# EasyEDA Pro project ProPrj_STM32G474RET6_2026-01-30.epro, schematic Schematic2
Board Name: Board2; Create Date: 2025-07-26; Page Name: P1; Project Name: STM32G474RET6; Schematic Name: Schematic2; Update Date: 2025-07-26; Company: 嘉立创EDA; Page Size: A2; Version: V1.0
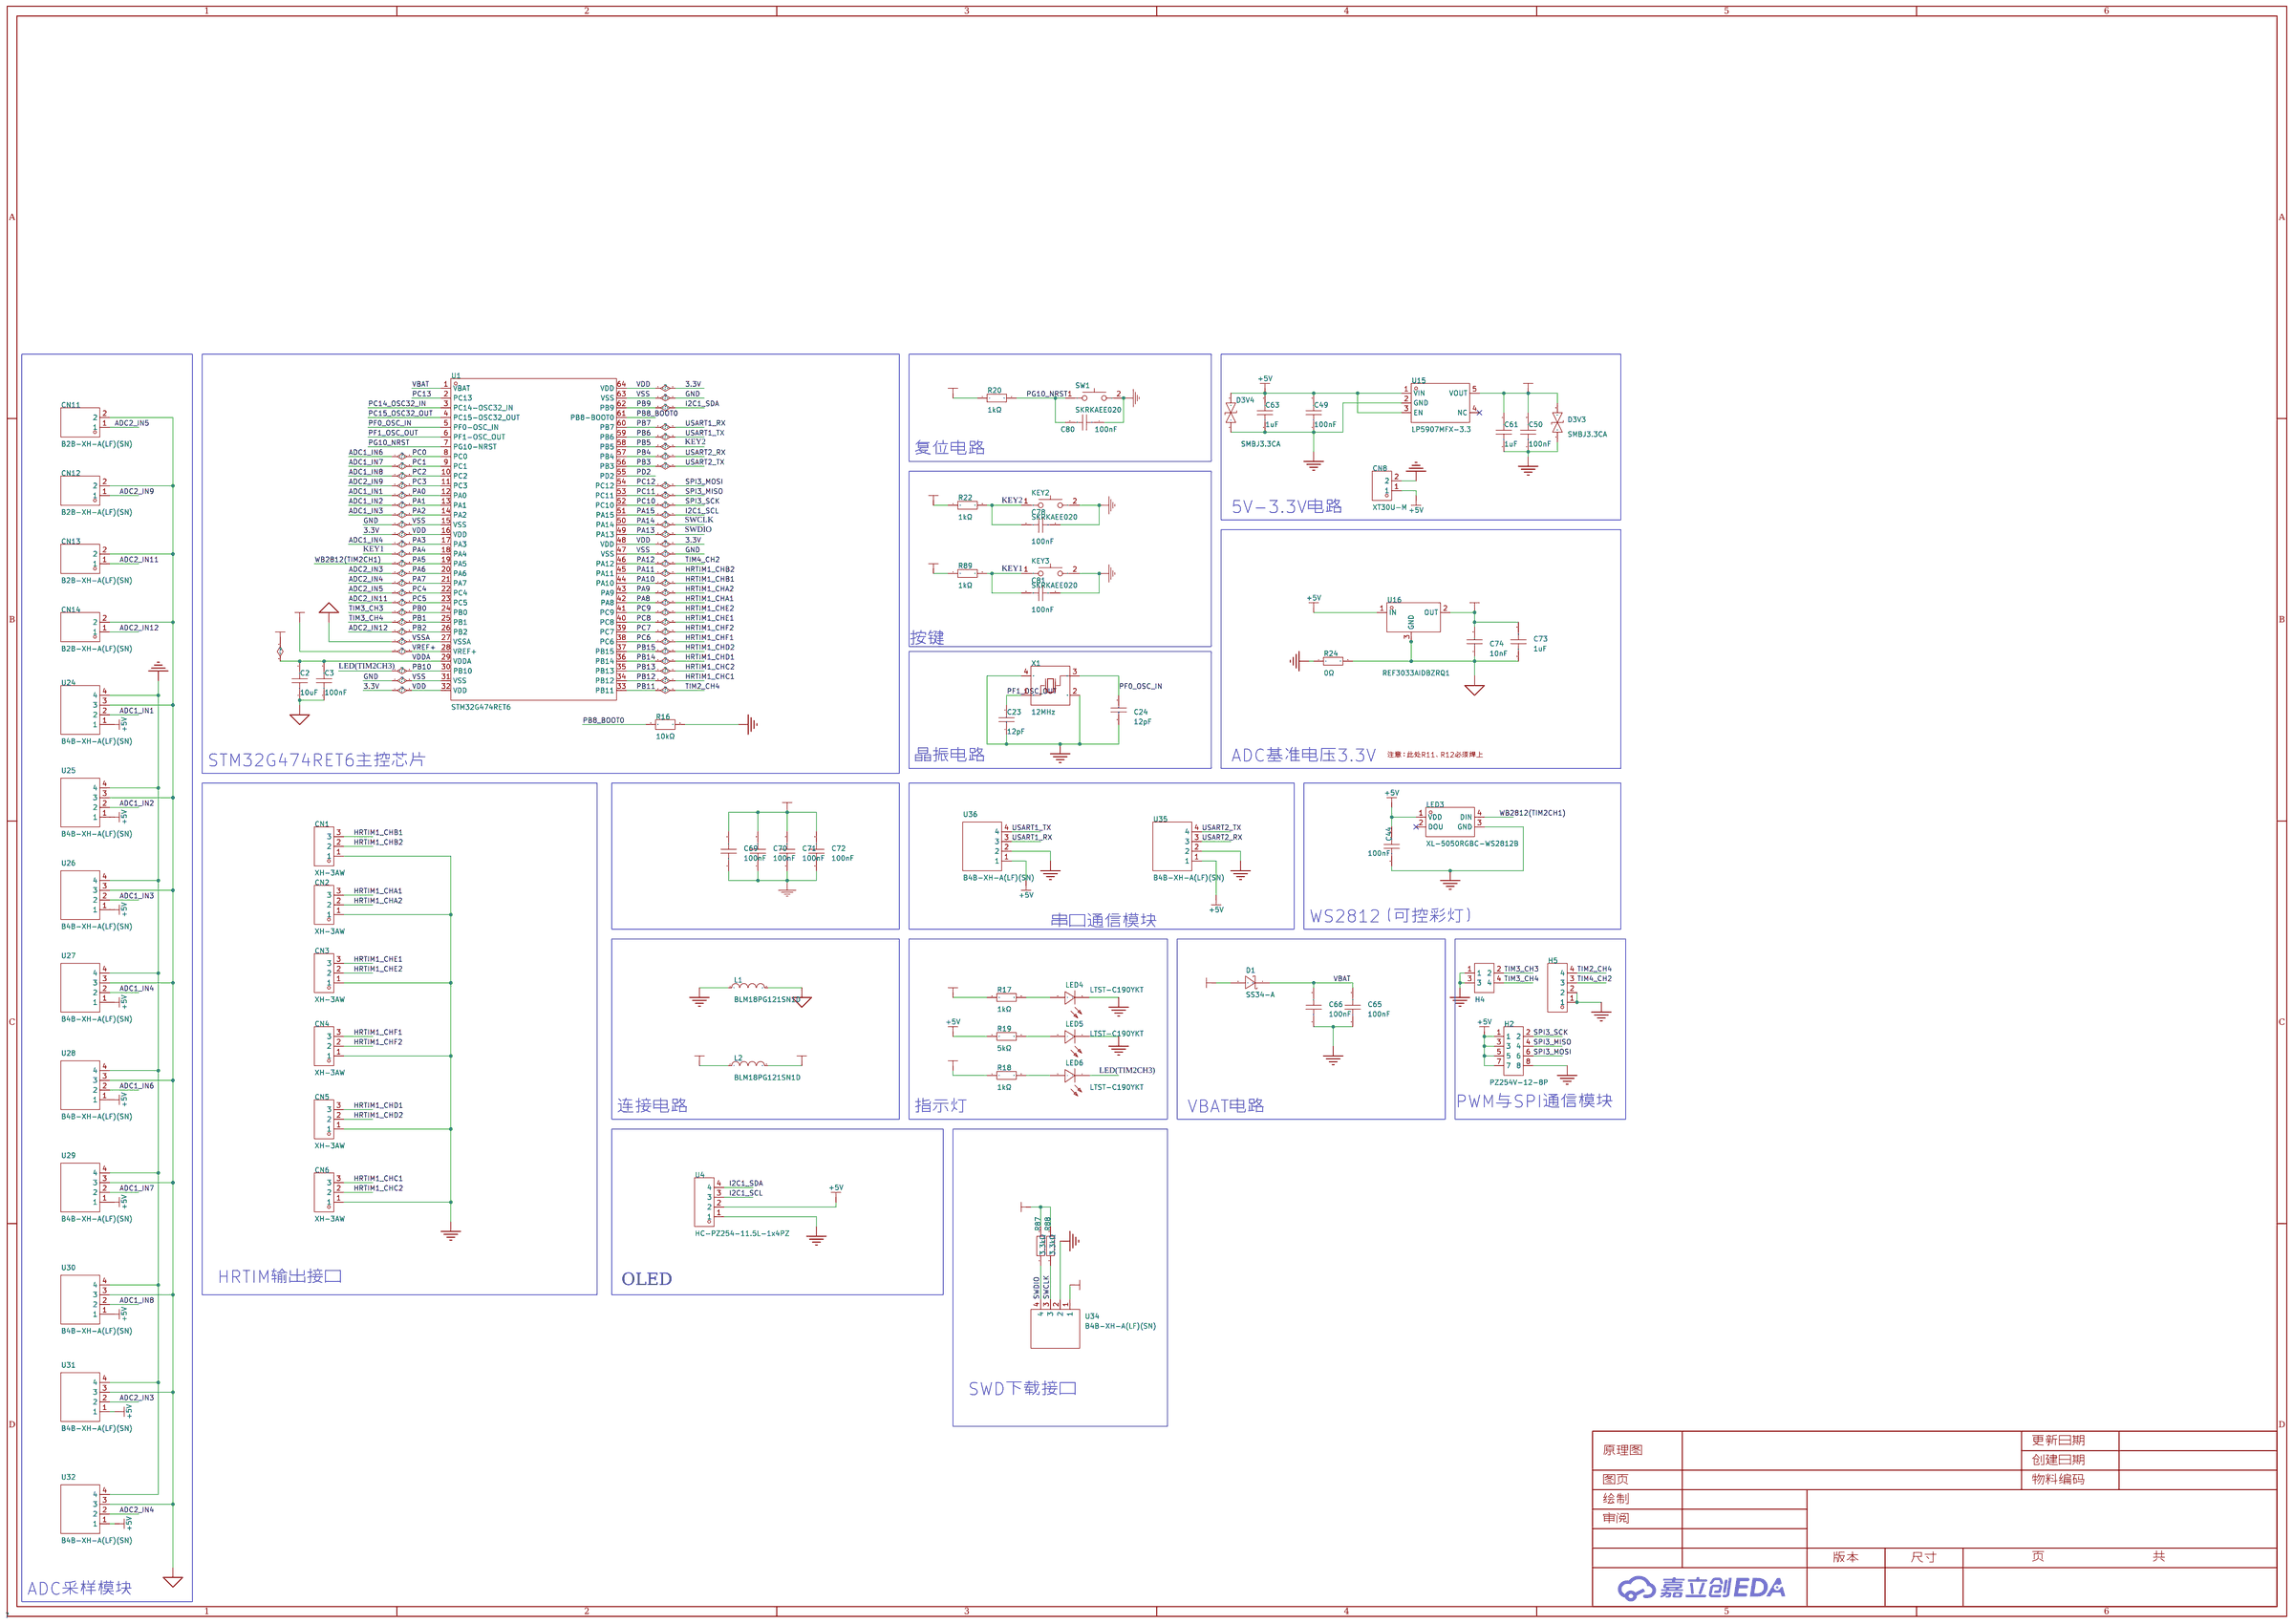
[diagram p1: schematic sheet]

## Parts
C2  10uF  [C0603]
C3  100nF  [C0603]
C23  12pF  [C0603]
C24  12pF  [C0603]
C44  100nF  [C0603]
C49  100nF  [C0603]
C50  100nF  [C0603]
C61  1uF  [C0603]
C63  1uF  [C0603]
C65  100nF  [C0603]
C66  100nF  [C0603]
C69  100nF  [C0603]
C70  100nF  [C0603]
C71  100nF  [C0603]
C72  100nF  [C0603]
C73  1uF  [C0603]
C74  10nF  [C0603]
C78  100nF  [C0603]
C80  100nF  [C0603]
C81  100nF  [C0603]
CN1  XH-3AW  [CONN-TH_3P-P2.54_HCTL_XH-3AW]
CN2  XH-3AW  [CONN-TH_3P-P2.54_HCTL_XH-3AW]
CN3  XH-3AW  [CONN-TH_3P-P2.54_HCTL_XH-3AW]
CN4  XH-3AW  [CONN-TH_3P-P2.54_HCTL_XH-3AW]
CN5  XH-3AW  [CONN-TH_3P-P2.54_HCTL_XH-3AW]
CN6  XH-3AW  [CONN-TH_3P-P2.54_HCTL_XH-3AW]
CN8  XT30U-M  [CONN-TH_XT30U-M]
CN11  B2B-XH-A(LF)(SN)  [CONN-TH_B2B-XH-A-LF-SN]
CN12  B2B-XH-A(LF)(SN)  [CONN-TH_B2B-XH-A-LF-SN]
CN13  B2B-XH-A(LF)(SN)  [CONN-TH_B2B-XH-A-LF-SN]
CN14  B2B-XH-A(LF)(SN)  [CONN-TH_B2B-XH-A-LF-SN]
D1  SS34-A  [SMA_L4.3-W2.6-LS5.2-RD]
D3V3  SMBJ3.3CA  [SMB_L4.6-W3.5-LS5.3-BI]
D3V4  SMBJ3.3CA  [SMB_L4.6-W3.5-LS5.3-BI]
H2  PZ254V-12-8P  [HDR-TH_8P-P2.54-V-M-R2-C4-S2.54]
H4  PZ254V-12-4P  [HDR-TH_4P-P2.54-V-M-R2-C2-S2.54]
H5  PZ254V-11-04P  [HDR-TH_4P-P2.54-V-M]
KEY2  SKRKAEE020  [SW-SMD_L3.9-W3.0-P4.45]
KEY3  SKRKAEE020  [SW-SMD_L3.9-W3.0-P4.45]
L1  BLM18PG121SN1D  [L0603]
L2  BLM18PG121SN1D  [L0603]
LED3  XL-5050RGBC-WS2812B  [LED-SMD_4P-L5.0-W5.0-BL_XL-5050RGBC]
LED4  LTST-C190YKT  [LED0603-RD]
LED5  LTST-C190YKT  [LED0603-RD]
LED6  LTST-C190YKT  [LED0603-RD]
R16  10kΩ  [R0603]
R17  1kΩ  [R0603]
R18  1kΩ  [R0603]
R19  5kΩ  [R0603]
R20  1kΩ  [R0603]
R22  1kΩ  [R0603]
R24  0Ω  [R0603]
R87  3.3kΩ  [R0603]
R88  3.3kΩ  [R0603]
R89  1kΩ  [R0603]
SW1  SKRKAEE020  [SW-SMD_L3.9-W3.0-P4.45]
U1  STM32G474RET6  [LQFP-64_L10.0-W10.0-P0.50-LS12.0-BL]
U4  HC-PZ254-11.5L-1x4PZ  [HDR-TH_4P-P2.54-V-M-4]
U15  LP5907MFX-3.3  [SOT-23-5_L3.0-W1.7-P0.95-LS2.8-BR]
U16  REF3033AIDBZRQ1  [SOT-23-3_L2.9-W1.3-P1.90-LS2.4-BR]
U24  B4B-XH-A(LF)(SN)  [CONN-TH_B4B-XH-A-LF-SN]
U25  B4B-XH-A(LF)(SN)  [CONN-TH_B4B-XH-A-LF-SN]
U26  B4B-XH-A(LF)(SN)  [CONN-TH_B4B-XH-A-LF-SN]
U27  B4B-XH-A(LF)(SN)  [CONN-TH_B4B-XH-A-LF-SN]
U28  B4B-XH-A(LF)(SN)  [CONN-TH_B4B-XH-A-LF-SN]
U29  B4B-XH-A(LF)(SN)  [CONN-TH_B4B-XH-A-LF-SN]
U30  B4B-XH-A(LF)(SN)  [CONN-TH_B4B-XH-A-LF-SN]
U31  B4B-XH-A(LF)(SN)  [CONN-TH_B4B-XH-A-LF-SN]
U32  B4B-XH-A(LF)(SN)  [CONN-TH_B4B-XH-A-LF-SN]
U34  B4B-XH-A(LF)(SN)  [CONN-TH_B4B-XH-A-LF-SN]
U35  B4B-XH-A(LF)(SN)  [CONN-TH_B4B-XH-A-LF-SN]
U36  B4B-XH-A(LF)(SN)  [CONN-TH_B4B-XH-A-LF-SN]
X1  12MHz  [CRYSTAL-SMD_4P-L3.2-W2.5-BL]

## Library data of the parts
C2 = CGA0603X5R106K100JT: 容值:10uF;精度:±10%;额定电压:10V;温度系数:X5R;; LCSC Part Name: 10uF ±10% 10V; Supplier Part: C6119842; Manufacturer: HRE(芯声); Supplier Footprint: 0603; JLCPCB Part Class: 扩展库; Supplier: LCSC; Tolerance: ±10%; Voltage Rating: 10V; Temperature Coefficient: X5R
C3 C65 C66 C69-C72 = CGA0603X7R104K500JT: 容值:100nF;精度:±10%;额定电压:50V;温度系数:X7R;; LCSC Part Name: 100nF ±10% 50V; Supplier Part: C6119867; Manufacturer: HRE(芯声); Supplier Footprint: 0603; JLCPCB Part Class: 扩展库; Datasheet: https://atta.szlcsc.com/upload/public/pdf/source/20250103/C44077DA9E7B3EFAE02F22B6D3D1CBC9.pdf; Supplier: LCSC; Tolerance: ±10%; Voltage Rating: 50V; Temperature Coefficient: X7R
C23 C24 = CC0603JRNPO9BN120: 容值:12pF;精度:±5%;额定电压:50V;材质(温度系数):NP0;; LCSC Part Name: 12pF ±5% 50V; Supplier Part: C107034; Manufacturer: YAGEO(国巨); Supplier Footprint: 0603; JLCPCB Part Class: Extended Part; Datasheet: https://atta.szlcsc.com/upload/public/pdf/source/20170420/1492670686468.pdf; Supplier: LCSC; Tolerance: ±5%; Voltage Rated: 50V; Temperature Coefficient: NP0
C44 = CGA0603X7R104K500JT: 容值:100nF;精度:±10%;额定电压:50V;温度系数:X7R;; LCSC Part Name: 100nF ±10% 50V; Supplier Part: C6119867; Manufacturer: HRE(芯声); Supplier Footprint: 0603; JLCPCB Part Class: 扩展库; Datasheet: https://atta.szlcsc.com/upload/public/pdf/source/20250103/C44077DA9E7B3EFAE02F22B6D3D1CBC9.pdf; Supplier: LCSC; Tolerance: ±10%; Voltage Rating: 50V; Temperature Coefficient: X7R; Voltage Rated: 50V
C49 C50 C78 C80 C81 = CGA0603X7R104K500JT: 容值:100nF;精度:±10%;额定电压:50V;温度系数:X7R;; LCSC Part Name: 100nF ±10% 50V; Supplier Part: C6119867; Manufacturer: HRE(芯声); Supplier Footprint: 0603; JLCPCB Part Class: 扩展库; Datasheet: https://atta.szlcsc.com/upload/public/pdf/source/20250103/C44077DA9E7B3EFAE02F22B6D3D1CBC9.pdf; Supplier: LCSC; Tolerance: ±10%; Voltage Rating: 50V; Temperature Coefficient: X7R; Voltage Rated: 50V; Check: true
C61 C63 = CGA0603X5R105K160JT: 容值:1uF;精度:±10%;额定电压:16V;材质(温度系数):X5R;; LCSC Part Name: 1uF ±10% 16V; Supplier Part: C6119849; Manufacturer: HRE(芯声); Supplier Footprint: 0603; JLCPCB Part Class: 扩展库; Supplier: LCSC; Tolerance: ±10%; Voltage Rated: 16V; Temperature Coefficient: X5R
C73 = CGA0603X5R105K500JT: 容值:1uF;精度:±10%;额定电压:50V;温度系数:X5R;; LCSC Part Name: 1uF ±10% 50V; Supplier Part: C6119852; Manufacturer: HRE(芯声); Supplier Footprint: 0603; JLCPCB Part Class: 扩展库; Supplier: LCSC; Tolerance: ±10%; Voltage Rating: 50V; Temperature Coefficient: X5R
C74 = CC0603KRX7R9BB103: 容值:10nF;精度:±10%;额定电压:50V;材质(温度系数):X7R;; LCSC Part Name: 10nF ±10% 50V; Supplier Part: C100042; Manufacturer: YAGEO(国巨); Supplier Footprint: 0603; JLCPCB Part Class: 扩展库; Datasheet: https://atta.szlcsc.com/upload/public/pdf/source/20181008/C309510_22F155564471FAF6A489F7D68F34234E.pdf; Supplier: LCSC; Tolerance: ±10%; Voltage Rated: 50V; Temperature Coefficient: X7R
CN1-CN6 = XH-3AW_C2908612: 插针结构:1x3P;间距:2.54mm;安装方式:弯插;参考系列:XH;总PIN数:3P;排数:1;每排PIN数:3;行距:-;额定电流:3A;触头材质:黄铜;触头镀层:锡;工作温度范围:-25℃~+85℃;; LCSC Part Name: 1x3P 间距:2.54mm 弯插 系列:XH; Supplier Part: C2908612; Manufacturer: HCTL(华灿天禄); Supplier Footprint: 弯插,P=2.5mm; JLCPCB Part Class: 扩展库; Datasheet: https://atta.szlcsc.com/upload/public/pdf/source/20230711/B565BAF3B11666EF6B81B3605408F2BD.pdf; Supplier: LCSC; Pins Structure: 1x3P; Pitch: 2.54mm; Mounting Style: 弯插; Reference Series: XH; Number of Pins: 3P; Number of Rows: 1; Number of PINs Per Row: 3; Current Rating (Max): 3A; Contact Material: 黄铜; Contact Plating: 锡; Operating Temperature Range: -25℃~+85℃
CN8 = XT30U-M: 类别:-;类型1:-;; LCSC Part Name: AMASS(艾迈斯)轻量版锂电池插头公头 XT30U-M; Supplier Part: C99101; Manufacturer: AMASS(艾迈斯); JLCPCB Part Class: 扩展库; Datasheet: https://atta.szlcsc.com/upload/public/pdf/source/20170606/1496716542582.pdf; Supplier: LCSC; Type: 插头; Colour: 黄色; InterfaceType: 公头
CN11-CN14 = B2B-XH-A(LF)(SN): 插针结构:1x2P;间距:2.5mm;安装方式:直插;参考系列:XH;总PIN数:2P;排数:1;每排PIN数:2;行距:-;额定电流:3A;触头材质:黄铜;触头镀层:锡;工作温度范围:-25℃~+85℃;; LCSC Part Name: 1x2P 间距:2.5mm 直插 系列:XH; Supplier Part: C158012; Manufacturer: JST; Supplier Footprint: 插件,P=2.5mm; JLCPCB Part Class: 扩展库; Datasheet: https://atta.szlcsc.com/upload/public/pdf/source/20180928/C265283_F9DFEEBDB2CF642B6BDFAB4B77BD2680.pdf; Supplier: LCSC; Pins Structure: 1x2P; Pitch: 2.5mm; Mounting Style: 直插; Reference Series: XH; Number of Pins: 2P; Number of Rows: 1; Number of PINs Per Row: 2; Current Rating (Max): 3A; Contact Material: 黄铜; Contact Plating: 锡; Operating Temperature Range: -25℃~+85℃; Rated Voltage (Max): 250V; Plastic Material: PA66; Flame Retardant Rating: UL94V-0; Supplementary Features: 打K脚; Colour: 白色; Z-Height of the Board: 7mm; X-Length of Bottom Edge on Board (Spacing Line): 7.4mm; Y-Width of Bottom Edge on Board: 5.75mm
D1 = SS34-A: 直流反向耐压（Vr）:40V;平均整流电流（Io）:3A;正向压降（Vf）:550mV @ 3A;; LCSC Part Name: SS34; Supplier Part: C143201; Manufacturer: FMS(美丽微); Supplier Footprint: SMA(DO-214AC); JLCPCB Part Class: 扩展库; Datasheet: https://atta.szlcsc.com/upload/public/pdf/source/20171109/C143201_15102201697671103752.pdf; Supplier: LCSC
D3V3 D3V4 = SMBJ6.5CA_C7420377: 极性:双向;反向截止电压(Vrwm):6.5V;最大钳位电压:11.2V;峰值脉冲电流(Ipp)@10/1000us:53.57A;峰值脉冲功率(Ppp)@10/1000us:600W;击穿电压:7.22V;; LCSC Part Name: SMBJ6.5CA; Supplier Part: C7420377; Manufacturer: 宏迦橙; Supplier Footprint: SMB; JLCPCB Part Class: 扩展库; Datasheet: https://atta.szlcsc.com/upload/public/pdf/source/20240521/1CEEED45C5E1E6D6901B31DABD34A136.pdf; Supplier: LCSC; polarity: 双向; Reverse Stand-Off Voltage (Vrwm): 6.5V; Maximum Clamping Voltage: 11.2V; Peak Pulse Current (Ipp)@10/1000us: 53.57A; Peak Pulse Power Dissipation (Ppp)@10/1000us: 600W; Breakdown Voltage: 7.22V; Reverse Leakage Current (Ir): 500uA; Number of Lines: 单路; Operating Temperature: -55℃~+155℃; Type: TVS
H2 = PZ254V-12-8P: 插针结构:2x4P;间距:2.54mm;行距:2.54mm;圆针/方针:方针;安装方式:直插;排数:双排;总PIN位数:8P;额定电流:-;额定电压:-;配合针长度:6mm;塑高:2.5mm;端接针长度:3mm;触头材质:黄铜;触头镀层:-;工作温度:-40℃~+105℃;颜色:黑色;; LCSC Part Name: 2x4P 间距:2.54mm 方针 直插; Supplier Part: C492421; Manufacturer: XFCN(兴飞); Supplier Footprint: 插件,P=2.54mm; JLCPCB Part Class: 扩展库; Datasheet: https://atta.szlcsc.com/upload/public/pdf/source/20200309/C492421_DC8A206AF99CD7755BD4A5B0BC48200B.pdf; Supplier: LCSC; Pin Structure: 2x4P; Pitch: 2.54mm; Row Spacing: 2.54mm; Circluar Pins/Square Pins: 方针; Mounting Type: 直插; Number of Rows: 双排; Number of Pins: 8P; Length of Mating Pin: 6mm; Insulation Height: 2.5mm; Length of End Connection Pin: 3mm; Contact Material: 黄铜; Operating Temperature: -40℃~+105℃; Color: 黑色
H4 = PZ254V-12-4P: 插针结构:2x2P;间距:2.54mm;行距:2.54mm;圆针/方针:方针;安装方式:直插;排数:双排;总PIN位数:4P;额定电流:-;额定电压:-;配合针长度:6mm;塑高:2.5mm;端接针长度:3mm;触头材质:黄铜;触头镀层:-;工作温度:-40℃~+105℃;颜色:黑色;; LCSC Part Name: 2x2P 间距:2.54mm 方针 直插; Supplier Part: C492419; Manufacturer: XFCN(兴飞); Supplier Footprint: 插件,P=2.54mm; JLCPCB Part Class: 扩展库; Datasheet: https://atta.szlcsc.com/upload/public/pdf/source/20200309/C492419_0001C06E73AFF21BD0ED3D7CEEF46D29.pdf; Supplier: LCSC; Pin Structure: 2x2P; Pitch: 2.54mm; Row Spacing: 2.54mm; Circluar Pins/Square Pins: 方针; Mounting Type: 直插; Number of Rows: 双排; Number of Pins: 4P; Length of Mating Pin: 6mm; Insulation Height: 2.5mm; Length of End Connection Pin: 3mm; Contact Material: 黄铜; Operating Temperature: -40℃~+105℃; Color: 黑色
H5 = PZ254V-11-04P: 插针结构:1x4P;间距:2.54mm;行距:-;圆针/方针:方针;安装类型:直插;排数:单排;总PIN位数:4P;额定电流:3A;额定电压:250V;配合针长度:6mm;塑高:2.5mm;端接针长度:3mm;触头材质:-;工作温度范围:-40℃~+105℃;颜色:黑色;; LCSC Part Name: 间距:2.54mm 1x4P 直插 方针; Supplier Part: C2691448; Manufacturer: XFCN(兴飞); Supplier Footprint: 插件,P=2.54mm; JLCPCB Part Class: 扩展库; Datasheet: https://atta.szlcsc.com/upload/public/pdf/source/20200309/C492403_F9F19131791D08044AD4F84F8E751A34.pdf; Supplier: LCSC; Pin Structure: 1x4P; Pitch: 2.54mm; Circluar Pins/Square Pins: 方针; Mounting Type: 直插; Number of Rows: 单排; Number of Pins: 4P; Current Rating (Max): 3A; Voltage Rating (Max): 250V; Length of Mating Pin: 6mm; Insulation Height: 2.5mm; Length of End Connection Pin: 3mm; Operating Temperature Range: -40℃~+105℃; Color: 黑色
KEY2 KEY3 SW1 = SKRKAEE020: 触点电流:50mA;额定电压(DC):12V;电路结构:单刀单掷;安装方式:立贴;带灯:-;机械寿命:-;; LCSC Part Name: 3.9*2.9*2mm 立贴 轻触开关; Supplier Part: C115357; Manufacturer: ALPSALPINE(阿尔卑斯阿尔派); Supplier Footprint: SMD; JLCPCB Part Class: Extended Part; Datasheet: https://atta.szlcsc.com/upload/public/pdf/source/20170620/1497944814772.pdf; Supplier: LCSC; Contact Current: 50mA; Voltage Rating (DC): 12V; Circuit: 单刀单掷; Mounting Style: 立贴; Actuator Style: 圆形按钮; Switch Length: 3.9mm; Switch Width: 2.9mm; Switch Height: 2mm
L1 L2 = BLM18PG121SN1D: 标称阻抗@测试频率:120Ω@100MHz;误差:±25%;直流电阻(RDC):50mΩ;; LCSC Part Name: 单路 0603磁珠 阻抗120Ω@100MHz; Supplier Part: C14709; Manufacturer: muRata(村田); Supplier Footprint: 0603; JLCPCB Part Class: 基础库; Datasheet: https://atta.szlcsc.com/upload/public/pdf/source/20130704/1457706621422.pdf; Supplier: LCSC; Impedance @ Frequency: 120Ω@100MHz; Tolerance: ±25%; DC Resistance: 50mΩ; Current Rating: 2A; Circuits: 1
LED3 = XL-5050RGBC-WS2812B: 5050七彩幻彩透明贴片LED灯珠 5050 幻彩透明四脚 ws2812B 内置驱动IC; Supplier Part: C2843785; Manufacturer: XINGLIGHT(成兴光); Supplier Footprint: SMD5050; JLCPCB Part Class: 扩展库; Datasheet: https://atta.szlcsc.com/upload/public/pdf/source/20240412/E1004CAA80592E31D08BFE019083806F.pdf; Supplier: LCSC
LED4-LED6 = LTST-C190YKT: 发光颜色:黄色;正向电压(VF):2.1V;功率:60mW;正向电流:20mA;主波长:588nm;二极管配置:-;透镜颜色:无色透明透镜;色温:-;发光强度:6mcd;发光角度:130°;载带方式:-;工作温度:-55℃~+85℃;; LCSC Part Name: 黄灯; Supplier Part: C125097; Manufacturer: LITEON(光宝); Supplier Footprint: 0603; JLCPCB Part Class: 扩展库; Datasheet: https://atta.szlcsc.com/upload/public/pdf/source/20180326/C125097_8A610ECE31461EDC7D081EA09A856E73.pdf; Supplier: LCSC; Emitted Color: 黄色; Forward Voltage (VF): 2.1V; Power Dissipation: 60mW; Forward Current: 20mA; Dominant Wavelength: 588nm; Peak Wavelength: 585nm; Lens Color: 无色透明透镜; Luminous Intensity: 6mcd; Viewing Angle: 130°; Operating Temperature: -55℃~+85℃
R16 = FRC0603J103TS: 电阻类型:厚膜电阻;阻值:10kΩ;精度:±5%;功率:100mW;最大工作电压:75V;温度系数:±100ppm/℃;; LCSC Part Name: 10kΩ ±5% 100mW 厚膜电阻; Supplier Part: C2930027; Manufacturer: FOJAN(富捷); Supplier Footprint: 0603; JLCPCB Part Class: 扩展库; Datasheet: https://atta.szlcsc.com/upload/public/pdf/source/20211221/925EC7D7225764EE0046F22065062C87.pdf; Supplier: LCSC; Type: 厚膜电阻; Tolerance: ±5%; Power(Watts): 100mW; Overload Voltage (Max): 75V; Temperature Coefficient: ±100ppm/℃; Operating Temperature Range: -55℃~+155℃; Check: true
R17 R18 R20 R22 R89 = 0603WAF1001T5E: 电阻类型:厚膜电阻;阻值:1kΩ;精度:±1%;功率:100mW;最大工作电压:75V;温度系数:±100ppm/℃;; LCSC Part Name: 1kΩ ±1% 100mW 厚膜电阻; Supplier Part: C21190; Manufacturer: UNI-ROYAL(厚声); Supplier Footprint: 0603; JLCPCB Part Class: 基础库; Datasheet: https://atta.szlcsc.com/upload/public/pdf/source/20200306/C422600_1E6D84923E4A46A82E41ADD87F860B5C.pdf; Supplier: LCSC; Type: 厚膜电阻; Tolerance: ±1%; Power(Watts): 100mW; Overload Voltage (Max): 75V; Temperature Coefficient: ±100ppm/℃; Operating Temperature Range: -55℃~+155℃
R19 = RT0603BRE075KL: 电阻类型:薄膜电阻;阻值:5kΩ;精度:±0.1%;功率:100mW;温度系数:±50ppm/℃;; LCSC Part Name: 薄膜电阻 5kΩ ±0.1% 100mW; Supplier Part: C862232; Manufacturer: YAGEO(国巨); Supplier Footprint: 0603; JLCPCB Part Class: 扩展库; Datasheet: https://atta.szlcsc.com/upload/public/pdf/source/20200610/C326738_5639A9F1B6EB6E4AE2197577D3456E7F.pdf; Supplier: LCSC; Type: 薄膜电阻; Tolerance: ±0.1%; Power(Watts): 100mW; Temperature Coefficient: ±50ppm/℃; Operating Temperature Range: -55℃~+155℃
R24 = 0603WAF0000T5E: 电阻类型:厚膜电阻;阻值:0Ω;精度:±1%;功率:100mW;最大工作电压:75V;; LCSC Part Name: 0Ω ±1% 100mW 厚膜电阻; Supplier Part: C21189; Manufacturer: UNI-ROYAL(厚声); Supplier Footprint: 0603; JLCPCB Part Class: 基础库; Datasheet: https://atta.szlcsc.com/upload/public/pdf/source/20200306/C422600_1E6D84923E4A46A82E41ADD87F860B5C.pdf; Supplier: LCSC; Type: 厚膜电阻; Tolerance: ±1%; Power(Watts): 100mW; Overload Voltage (Max): 75V; Operating Temperature Range: -55℃~+155℃
R87 R88 = 0603WAF3301T5E: 电阻类型:厚膜电阻;阻值:3.3kΩ;精度:±1%;功率:100mW;最大工作电压:75V;温度系数:±100ppm/℃;; LCSC Part Name: 3.3kΩ ±1% 100mW 厚膜电阻; Supplier Part: C22978; Manufacturer: UNI-ROYAL(厚声); Supplier Footprint: 0603; JLCPCB Part Class: 基础库; Datasheet: https://atta.szlcsc.com/upload/public/pdf/source/20200306/C422600_1E6D84923E4A46A82E41ADD87F860B5C.pdf; Supplier: LCSC; Type: 厚膜电阻; Tolerance: ±1%; Power(Watts): 100mW; Overload Voltage (Max): 75V; Temperature Coefficient: ±100ppm/℃; Operating Temperature Range: -55℃~+155℃; Check: true
U1 = STM32G474RET6: CPU内核:ARM-M4;CPU最大主频:170MHz;应用领域:-;; LCSC Part Name: 带DSP和FPU的170MHz主流ARM Cortex-M4 MCU，具有512 KB Flash存储器、数学加速器、高分辨率定时器和高模拟电平集成; Supplier Part: C521608; Manufacturer: ST(意法半导体); Supplier Footprint: LQFP-64(10x10); JLCPCB Part Class: 扩展库; Datasheet: https://atta.szlcsc.com/upload/public/pdf/source/20200902/C431632_38212262685EE30B1989689374F08940.pdf; Supplier: LCSC; CPU Core: ARM-M4; CPU Maximum Speed: 170MHz; Program Storage Size: 512KB; Program Memory Type: FLASH; Number of I/O: 52; ADC (Bit): 12bit; DAC (Bit): 12bit; Voltage - Supply: 1.71V~3.6V
U4 = HC-PZ254-11.5L-1x4PZ: 插针结构:1x4P;间距:2.54mm;行距:-;圆针/方针:方针;安装类型:直插;排数:单排;总PIN位数:4P;额定电流:3A;配合针长度:6mm;塑高:2.5mm;端接针长度:3mm;触头材质:黄铜;触头镀层:金;工作温度范围:-40℃~+105℃;焊接温度(最大值):260℃;颜色:黑色;; LCSC Part Name: 间距2.54mm 1x4Pin 直插 H2.5 L11.5; Supplier Part: C27985189; Manufacturer: HC(虹成电子); Supplier Footprint: 插件,P=2.54mm; JLCPCB Part Class: 扩展库; Datasheet: https://atta.szlcsc.com/upload/public/pdf/source/20240710/CB85400293F297620DD48460C85CEAB6.pdf; Supplier: LCSC; Pin Structure: 1x4P; Pitch: 2.54mm; Circluar Pins/Square Pins: 方针; Mounting Type: 直插; Number of Rows: 单排; Number of Pins: 4P; Current Rating (Max): 3A; Length of Mating Pin: 6mm; Insulation Height: 2.5mm; Length of End Connection Pin: 3mm; Contact Material: 黄铜; Contact Plating: 金; Operating Temperature Range: -40℃~+105℃; Soldering Temperature(Max): 260℃; Color: 黑色; Check: true
U15 = LP5907MFX-3.3: LCSC Part Name: 集成电路; Supplier Part: C23380874; Manufacturer: TECH PUBLIC(台舟); Supplier Footprint: SOT-23-5; JLCPCB Part Class: 扩展库; Datasheet: https://atta.szlcsc.com/upload/public/pdf/source/20240628/E3C87EE4C6FB794C504E10122016F890.pdf; Supplier: LCSC; Check: true
U16 = REF3033AIDBZRQ1: 输出类型:固定;输入电压:3.35V~5.5V;输出电压:3.3V;输出电流:25mA;精度:±0.2%;; Supplier Part: C3680001; Manufacturer: TI(德州仪器); Supplier Footprint: SOT-23-3; JLCPCB Part Class: 扩展库; Datasheet: https://www.ti.com/cn/lit/gpn/ref3033-q1; Supplier: LCSC; Output Type: 固定; Input Voltage: 3.35V~5.5V; Output Voltage: 3.3V; Output Current: 25mA; Tolerance: ±0.2%; Temperature Coefficient: 75ppm/℃; Reference Type: 串联; Supply Current: 50uA; Noise - 1/10Hz to 10Hz: 36uVp-p; Noise - 10Hz to 10kHz: 105uVrms; Operating Temperature: -40℃~+85℃@(Ta)
U24-U32 U34-U36 = B4B-XH-A(LF)(SN): 插针结构:1x4P;间距:2.5mm;安装方式:直插;参考系列:XH;总PIN数:4P;排数:1;每排PIN数:4;行距:-;额定电流:3A;触头材质:黄铜;触头镀层:锡;工作温度范围:-25℃~+85℃;; LCSC Part Name: 1x4P 间距:2.5mm 直插 系列:XH; Supplier Part: C144395; Manufacturer: JST; Supplier Footprint: 插件,P=2.5mm; JLCPCB Part Class: 扩展库; Datasheet: https://atta.szlcsc.com/upload/public/pdf/source/20180928/C265283_F9DFEEBDB2CF642B6BDFAB4B77BD2680.pdf; Supplier: LCSC; Pins Structure: 1x4P; Pitch: 2.5mm; Mounting Style: 直插; Reference Series: XH; Number of Pins: 4P; Number of Rows: 1; Number of PINs Per Row: 4; Current Rating (Max): 3A; Contact Material: 黄铜; Contact Plating: 锡; Operating Temperature Range: -25℃~+85℃; Rated Voltage (Max): 250V; Plastic Material: PA66; Flame Retardant Rating: UL94V-0; Supplementary Features: 打K脚; Colour: 白色; Z-Height of the Board: 7mm; X-Length of Bottom Edge on Board (Spacing Line): 12.4mm; Y-Width of Bottom Edge on Board: 5.75mm
X1 = X322512MMB4SI: 晶振类型:贴片无源晶振;频率:12MHz;频率公差:±10ppm;频率稳定度:±30ppm;负载电容:10pF;工作温度:-40℃~+85℃;; LCSC Part Name: YSX321SL 12MHz ±10ppm 10pF; Supplier Part: C50430; Manufacturer: YXC(扬兴科技); Supplier Footprint: SMD3225-4P; JLCPCB Part Class: Extended Part; Datasheet: https://atta.szlcsc.com/upload/public/pdf/source/20210329/C112971_1F611BDC486E193C1706F6D8EB5AA189.pdf; Supplier: LCSC; Crystal Type: 贴片无源晶振; Frequency Tolerance: ±10ppm; Frequency Stability: ±30ppm; Load Capacitance: 10pF; Operating Temperature: -40℃~+85℃

## Nets
3.3V: C2.2 C3.2 C50.2 C61.2 C69.2 C70.2 C71.2 C72.2 D1.2(A) D3V3.2 L2.1 R17.1 R18.1 R20.1 R22.1 R87.2 R88.2 R89.1 U1.16(VDD) U1.29(VDDA) U1.32(VDD) U1.48(VDD) U1.64(VDD) U15.5(VOUT) U34.1
+5V: C44.1 C49.2 C63.2 CN8.1 D3V4.2 H2.1 H2.3 H2.5 H2.7 LED3.1(VDD) R19.1 U4.2 U15.1(VIN) U15.3(EN) U16.1(IN) U24.1 U25.1 U26.1 U27.1 U28.1 U29.1 U30.1 U31.1 U32.1 U35.1 U36.1
AGND: C2.1 C3.1 C73.1 C74.1 CN11.2 CN12.2 CN13.2 CN14.2 L1.2 R24.2 U1.27(VSSA) U16.3(GND) U24.3 U25.3 U26.3 U27.3 U28.3 U29.3 U30.3 U31.3 U32.3
GND: C23.1 C24.1 C44.2 C49.1 C50.1 C61.1 C63.1 C65.1 C66.1 C69.1 C70.1 C71.1 C72.1 C78.1 C80.1 C81.1 CN1.1 CN2.1 CN3.1 CN4.1 CN5.1 CN6.1 CN8.2 D3V3.1 D3V4.1 H2.8 H4.1 H4.3 H5.1 H5.2 KEY2.2 KEY3.2 L1.1 LED3.3(GND) LED4.1(-) LED5.1(-) R16.2 R24.1 SW1.2 U1.15(VSS) U1.31(VSS) U1.47(VSS) U1.63(VSS) U4.1 U15.2(GND) U24.4 U25.4 U26.4 U27.4 U28.4 U29.4 U30.4 U31.4 U32.4 U34.2 U35.2 U36.2 X1.2(GND) X1.4(GND)
VBAT: C65.2 C66.2 D1.1(C) U1.1(VBAT)
ADC1_IN1: U1.12(PA0) U24.2
ADC1_IN2: U1.13(PA1) U25.2
ADC1_IN3: U1.14(PA2) U26.2
ADC1_IN4: U1.17(PA3) U27.2
ADC1_IN6: U1.8(PC0) U28.2
ADC1_IN7: U1.9(PC1) U29.2
ADC1_IN8: U1.10(PC2) U30.2
ADC2_IN3: U1.20(PA6) U31.2
ADC2_IN4: U1.21(PA7) U32.2
ADC2_IN5: CN11.1 U1.22(PC4)
ADC2_IN9: CN12.1 U1.11(PC3)
ADC2_IN11: CN13.1 U1.23(PC5)
ADC2_IN12: CN14.1 U1.26(PB2)
HRTIM1_CHA1: CN2.3 U1.42(PA8)
HRTIM1_CHA2: CN2.2 U1.43(PA9)
HRTIM1_CHB1: CN1.3 U1.44(PA10)
HRTIM1_CHB2: CN1.2 U1.45(PA11)
HRTIM1_CHC1: CN6.3 U1.34(PB12)
HRTIM1_CHC2: CN6.2 U1.35(PB13)
HRTIM1_CHD1: CN5.3 U1.36(PB14)
HRTIM1_CHD2: CN5.2 U1.37(PB15)
HRTIM1_CHE1: CN3.3 U1.40(PC8)
HRTIM1_CHE2: CN3.2 U1.41(PC9)
HRTIM1_CHF1: CN4.3 U1.38(PC6)
HRTIM1_CHF2: CN4.2 U1.39(PC7)
I2C1_SCL: U1.51(PA15) U4.3
I2C1_SDA: U1.62(PB9) U4.4
KEY1: C81.2 KEY3.1 R89.2 U1.18(PA4)
KEY2: C78.2 KEY2.1 R22.2 U1.58(PB5)
LED(TIM2CH3): LED6.1(-) U1.30(PB10)
PA5: LED3.4(DIN) U1.19(PA5)
PA12: H5.3 U1.46(PA12)
PA13: R87.1 U1.49(PA13) U34.4
PA14: R88.1 U1.50(PA14) U34.3
PB0: H4.2 U1.24(PB0)
PB1: H4.4 U1.25(PB1)
PB3: U1.56(PB3) U35.4
PB4: U1.57(PB4) U35.3
PB6: U1.59(PB6) U36.4
PB7: U1.60(PB7) U36.3
PB8_BOOT0: R16.1 U1.61(PB8-BOOT0)
PB11: H5.4 U1.33(PB11)
PC10: H2.2 U1.52(PC10)
PC11: H2.4 U1.53(PC11)
PC12: H2.6 U1.54(PC12)
PC13: U1.2(PC13)
PC14_OSC32_IN: U1.3(PC14-OSC32_IN)
PC15_OSC32_OUT: U1.4(PC15-OSC32_OUT)
PD2: U1.55(PD2)
PF0_OSC_IN: C24.2 U1.5(PF0-OSC_IN) X1.3(OSC2)
PF1_OSC_OUT: C23.2 U1.6(PF1-OSC_OUT) X1.1(OSC1)
PG10_NRST: C80.2 R20.2 SW1.1 U1.7(PG10-NRST)
VREF: C73.2 C74.2 L2.2 U1.28(VREF+) U16.2(OUT)
$1N4726: LED5.2(+) R19.2
$1N4727: LED4.2(+) R17.2
$1N4730: LED6.2(+) R18.2

Not connected (* = marked no-connect by the designer): LED3 2(DOU)*; U15 4(NC)*

## Notes on the sheet
- 复位电路
- 5V-3.3V电路
- 按键
- STM32G474RET6主控芯片
- 晶振电路
- ADC基准电压3.3V
- 注意：此处R11、R12必须焊上
- 串口通信模块
- WS2812（可控彩灯）
- PWM与SPI通信模块
- 连接电路
- 指示灯
- VBAT电路
- HRTIM输出接口
- OLED
- SWD下载接口
- ADC采样模块
